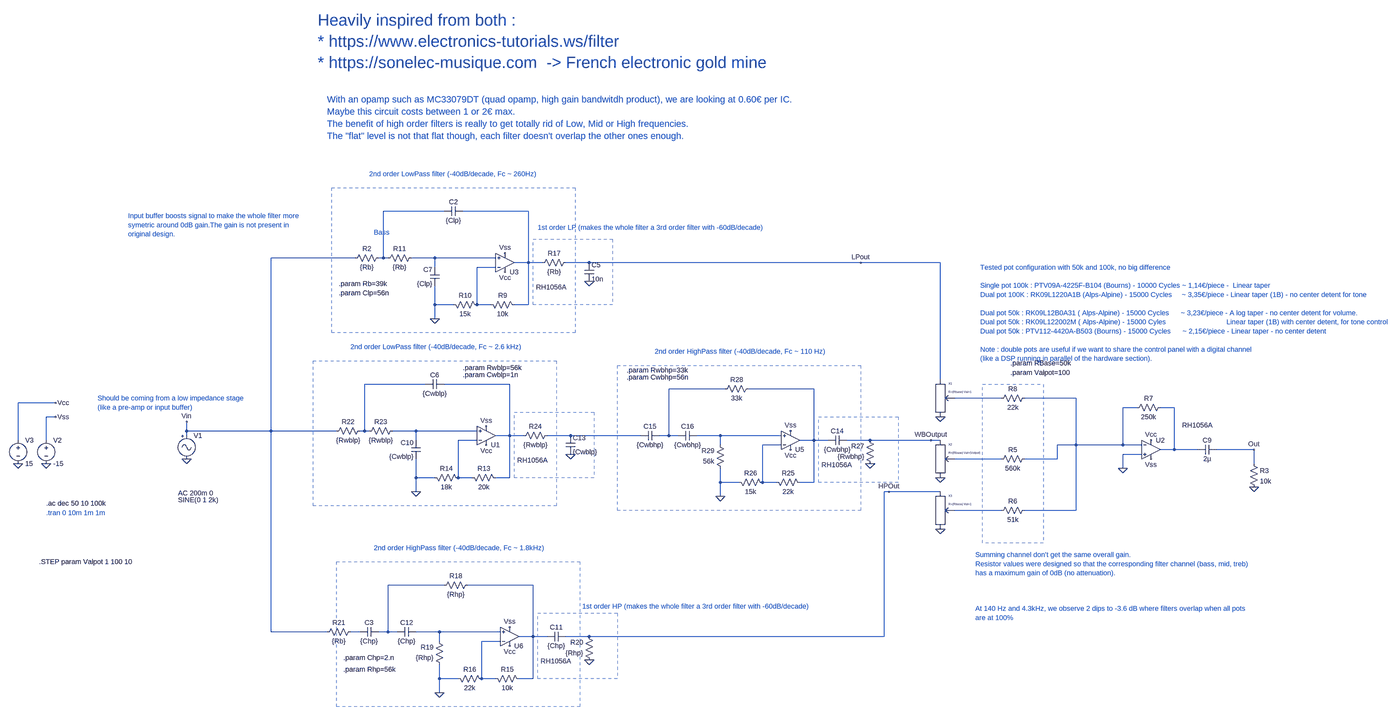
[diagram p0: schematic ActiveTMBInputTonestack.asc, whole sheet]
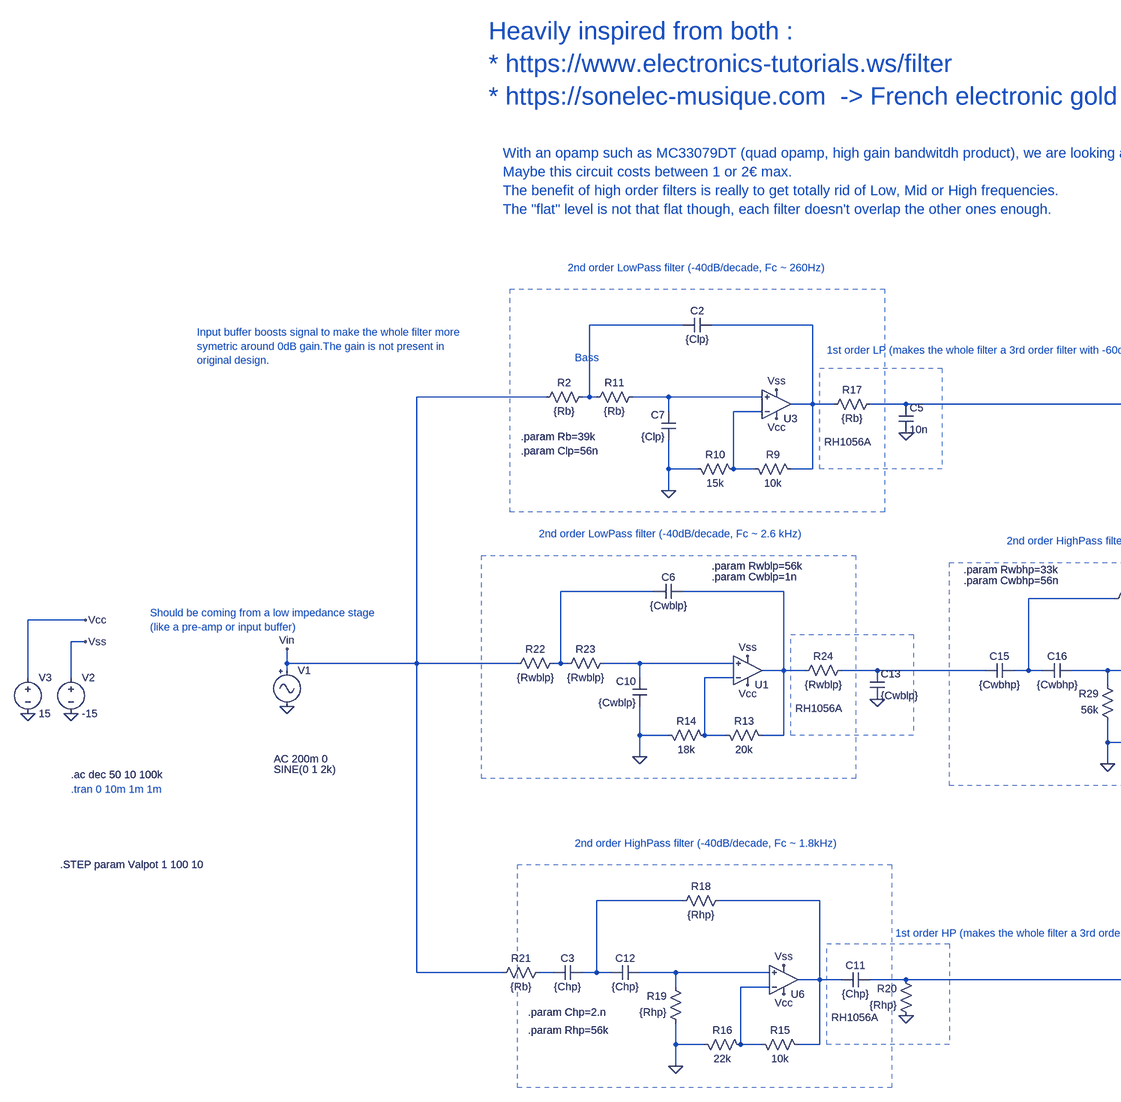
[diagram p1: schematic ActiveTMBInputTonestack.asc, part, row 1 of 1, column 1 of 2]
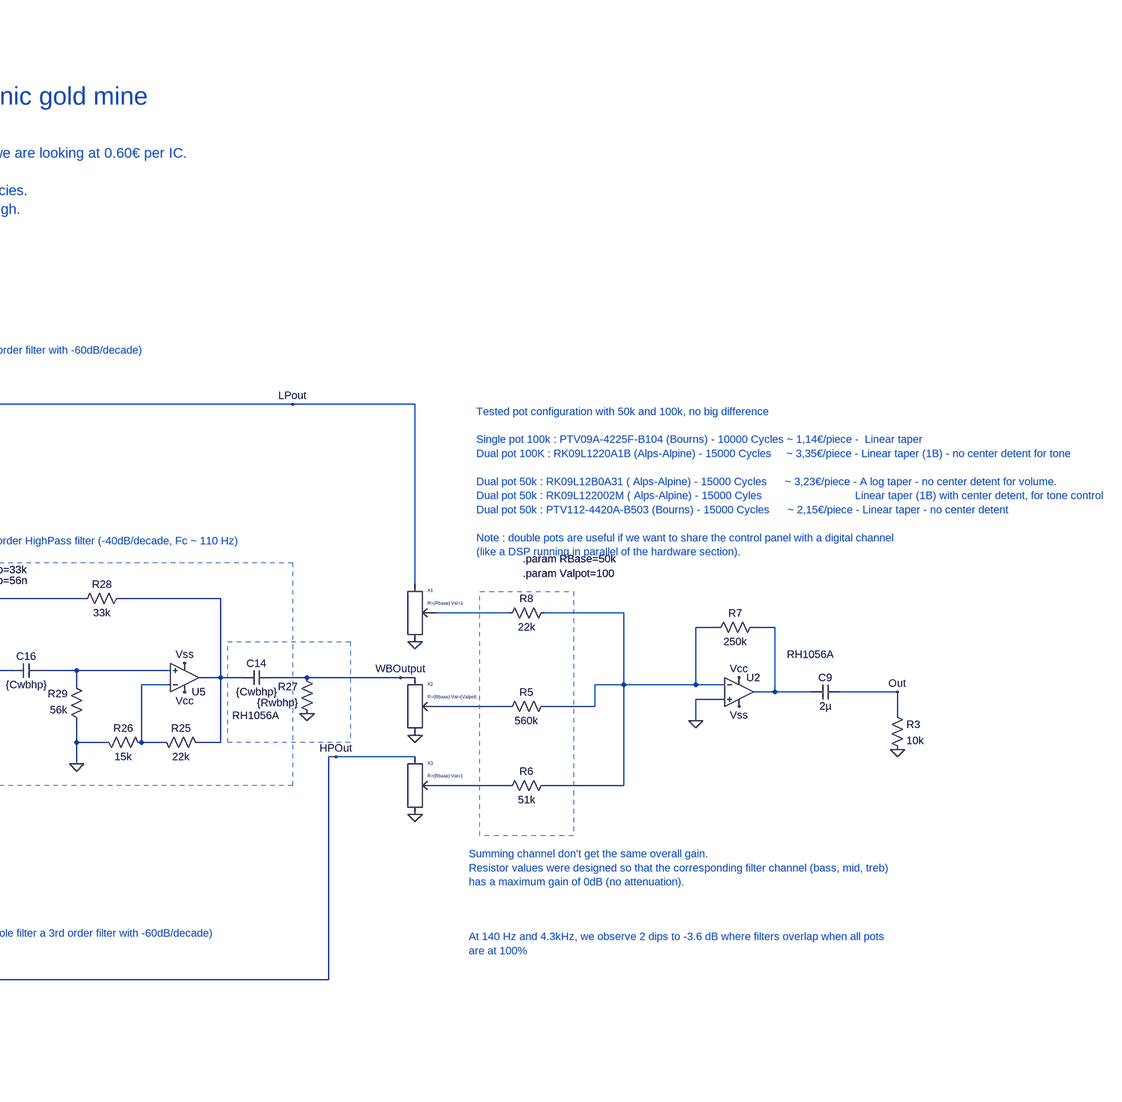
[diagram p2: schematic ActiveTMBInputTonestack.asc, part, row 1 of 1, column 2 of 2]
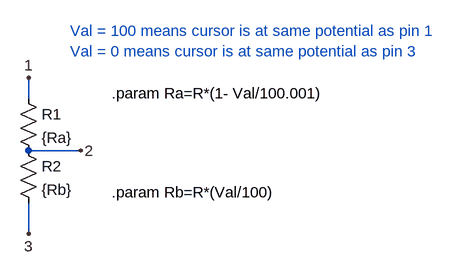
[diagram p3: sub-circuit potentiometer.asc]
ActiveTMBInputTonestack.asc, the LTspice schematic file:
Version 4
SHEET 1 4712 2500
WIRE 704 -304 496 -304
WIRE 992 -304 768 -304
WIRE 400 -144 112 -144
WIRE 496 -144 496 -304
WIRE 496 -144 480 -144
WIRE 512 -144 496 -144
WIRE 672 -144 592 -144
WIRE 880 -144 672 -144
WIRE 992 -128 992 -304
WIRE 992 -128 944 -128
WIRE 1040 -128 992 -128
WIRE 1200 -128 1120 -128
WIRE 2128 -128 1200 -128
WIRE 2400 -128 2128 -128
WIRE 672 -112 672 -144
WIRE 880 -112 816 -112
WIRE 672 16 672 -48
WIRE 736 16 672 16
WIRE 816 16 816 -112
WIRE 864 16 816 16
WIRE 992 16 992 -128
WIRE 992 16 944 16
WIRE 672 64 672 16
WIRE 2400 272 2400 -128
WIRE 640 288 432 288
WIRE 928 288 704 288
WIRE 1664 304 1472 304
WIRE 1968 304 1744 304
WIRE 2608 336 2448 336
WIRE 2864 336 2688 336
WIRE -624 352 -752 352
WIRE 3072 368 3024 368
WIRE 3200 368 3152 368
WIRE -624 400 -656 400
WIRE -176 448 -176 416
WIRE 112 448 112 -144
WIRE 112 448 -176 448
WIRE 336 448 112 448
WIRE 432 448 432 288
WIRE 432 448 416 448
WIRE 448 448 432 448
WIRE 608 448 528 448
WIRE 816 448 608 448
WIRE -176 464 -176 448
WIRE 928 464 928 288
WIRE 928 464 880 464
WIRE 976 464 928 464
WIRE 1136 464 1056 464
WIRE 1376 464 1136 464
WIRE 1472 464 1472 304
WIRE 1472 464 1440 464
WIRE 1504 464 1472 464
WIRE 1648 464 1568 464
WIRE 1856 464 1648 464
WIRE -752 480 -752 352
WIRE -656 480 -656 400
WIRE 608 480 608 448
WIRE 816 480 752 480
WIRE 1968 480 1968 304
WIRE 1968 480 1920 480
WIRE 2016 480 1968 480
WIRE 2160 480 2080 480
WIRE 2368 480 2160 480
WIRE 2400 480 2368 480
WIRE 1648 496 1648 464
WIRE 1856 496 1792 496
WIRE 2864 496 2864 336
WIRE 2864 496 2800 496
WIRE 3024 496 3024 368
WIRE 3024 496 2864 496
WIRE 3088 496 3024 496
WIRE 3200 512 3200 368
WIRE 3200 512 3152 512
WIRE 3280 512 3200 512
WIRE 3472 512 3344 512
WIRE 3088 528 3024 528
WIRE 2608 544 2448 544
WIRE 2800 544 2800 496
WIRE 2800 544 2688 544
WIRE 3472 560 3472 512
WIRE 3024 576 3024 528
WIRE 608 608 608 544
WIRE 672 608 608 608
WIRE 752 608 752 480
WIRE 800 608 752 608
WIRE 928 608 928 464
WIRE 928 608 880 608
WIRE 1648 624 1648 576
WIRE 1712 624 1648 624
WIRE 1792 624 1792 496
WIRE 1840 624 1792 624
WIRE 1968 624 1968 480
WIRE 1968 624 1920 624
WIRE 608 656 608 608
WIRE 2224 656 2208 656
WIRE 2400 656 2224 656
WIRE 1648 672 1648 624
WIRE 2608 720 2448 720
WIRE 2864 720 2864 496
WIRE 2864 720 2688 720
WIRE 704 976 512 976
WIRE 1008 976 784 976
WIRE 112 1136 112 448
WIRE 304 1136 112 1136
WIRE 416 1136 384 1136
WIRE 512 1136 512 976
WIRE 512 1136 480 1136
WIRE 544 1136 512 1136
WIRE 688 1136 608 1136
WIRE 896 1136 688 1136
WIRE 1008 1152 1008 976
WIRE 1008 1152 960 1152
WIRE 1056 1152 1008 1152
WIRE 1200 1152 1120 1152
WIRE 2208 1152 2208 656
WIRE 2208 1152 1200 1152
WIRE 688 1168 688 1136
WIRE 896 1168 832 1168
WIRE 688 1296 688 1248
WIRE 752 1296 688 1296
WIRE 832 1296 832 1168
WIRE 880 1296 832 1296
WIRE 1008 1296 1008 1152
WIRE 1008 1296 960 1296
WIRE 688 1344 688 1296
FLAG -752 560 0
FLAG -656 560 0
FLAG -176 544 0
FLAG 3472 640 0
FLAG 3472 512 Out
FLAG 2400 608 0
FLAG 2400 784 0
FLAG 3120 480 Vcc
FLAG 3120 544 Vss
FLAG 3024 576 0
FLAG 912 -96 Vcc
FLAG 912 -160 Vss
FLAG 672 64 0
FLAG 2400 400 0
FLAG 1200 -64 0
FLAG 2128 -128 LPout
FLAG 928 1184 Vcc
FLAG 928 1120 Vss
FLAG 688 1344 0
FLAG 1200 1232 0
FLAG 2224 656 HPOut
FLAG -176 416 Vin
FLAG -624 400 Vss
FLAG -624 352 Vcc
FLAG 848 496 Vcc
FLAG 848 432 Vss
FLAG 608 656 0
FLAG 1136 528 0
FLAG 1888 512 Vcc
FLAG 1888 448 Vss
FLAG 1648 672 0
FLAG 2160 560 0
FLAG 2368 480 WBOutput
SYMBOL Misc\\signal -176 448 R0
WINDOW 123 -29 213 Left 2
WINDOW 39 0 0 Left 0
WINDOW 3 -29 236 Left 2
SYMATTR Value2 AC 200m 0
SYMATTR Value SINE(0 1 2k)
SYMATTR InstName V1
SYMBOL voltage -656 464 R0
WINDOW 123 0 0 Left 0
WINDOW 39 0 0 Left 0
SYMATTR InstName V2
SYMATTR Value -15
SYMBOL voltage -752 464 R0
WINDOW 123 0 0 Left 0
WINDOW 39 0 0 Left 0
SYMATTR InstName V3
SYMATTR Value 15
SYMBOL res 3456 544 R0
SYMATTR InstName R3
SYMATTR Value 10k
SYMBOL cap 3344 496 R90
WINDOW 0 0 32 VBottom 2
WINDOW 3 32 32 VTop 2
SYMATTR InstName C9
SYMATTR Value 2µ
SYMBOL Potentiometer 2400 544 R0
WINDOW 39 28 -21 Left 0
SYMATTR SpiceLine R={Rbase} Val={Valpot}
SYMATTR InstName X2
SYMBOL Potentiometer 2400 720 R0
WINDOW 39 28 -21 Left 0
SYMATTR SpiceLine R={Rbase} Val=1
SYMATTR InstName X3
SYMBOL OpAmps\\RH1056A 3120 448 R0
WINDOW 3 106 -20 Left 2
SYMATTR InstName U2
SYMBOL res 3168 352 R90
WINDOW 0 0 56 VBottom 2
WINDOW 3 32 56 VTop 2
SYMATTR InstName R7
SYMATTR Value 250k
SYMBOL res 2704 320 R90
WINDOW 0 0 56 VBottom 2
WINDOW 3 32 56 VTop 2
SYMATTR InstName R8
SYMATTR Value 22k
SYMBOL res 2704 528 R90
WINDOW 0 0 56 VBottom 2
WINDOW 3 32 56 VTop 2
SYMATTR InstName R5
SYMATTR Value 560k
SYMBOL res 2704 704 R90
WINDOW 0 0 56 VBottom 2
WINDOW 3 32 56 VTop 2
SYMATTR InstName R6
SYMATTR Value 51k
SYMBOL OpAmps\\RH1056A 912 -64 M180
WINDOW 3 106 -20 Left 2
SYMATTR InstName U3
SYMBOL res 960 32 M270
WINDOW 0 32 56 VTop 2
WINDOW 3 0 56 VBottom 2
SYMATTR InstName R9
SYMATTR Value 10k
SYMBOL res 832 32 M270
WINDOW 0 32 56 VTop 2
WINDOW 3 0 56 VBottom 2
SYMATTR InstName R10
SYMATTR Value 15k
SYMBOL cap 768 -320 R90
WINDOW 0 0 32 VBottom 2
WINDOW 3 32 32 VTop 2
SYMATTR InstName C2
SYMATTR Value {Clp}
SYMBOL cap 688 -48 R180
WINDOW 0 24 56 Left 2
WINDOW 3 24 8 Left 2
SYMATTR InstName C7
SYMATTR Value {Clp}
SYMBOL res 496 -160 R90
WINDOW 0 0 56 VBottom 2
WINDOW 3 32 56 VTop 2
SYMATTR InstName R2
SYMATTR Value {Rb}
SYMBOL res 608 -160 R90
WINDOW 0 0 56 VBottom 2
WINDOW 3 32 56 VTop 2
SYMATTR InstName R11
SYMATTR Value {Rb}
SYMBOL Potentiometer 2400 336 R0
WINDOW 39 28 -21 Left 0
SYMATTR SpiceLine R={Rbase} Val=1
SYMATTR InstName X1
SYMBOL res 1136 -144 R90
WINDOW 0 0 56 VBottom 2
WINDOW 3 32 56 VTop 2
SYMATTR InstName R17
SYMATTR Value {Rb}
SYMBOL cap 1184 -128 R0
SYMATTR InstName C5
SYMATTR Value 10n
SYMBOL OpAmps\\RH1056A 928 1216 M180
WINDOW 3 106 -20 Left 2
SYMATTR InstName U6
SYMBOL res 976 1312 M270
WINDOW 0 32 56 VTop 2
WINDOW 3 0 56 VBottom 2
SYMATTR InstName R15
SYMATTR Value 10k
SYMBOL res 848 1312 M270
WINDOW 0 32 56 VTop 2
WINDOW 3 0 56 VBottom 2
SYMATTR InstName R16
SYMATTR Value 22k
SYMBOL res 1216 1248 R180
WINDOW 0 36 76 Left 2
WINDOW 3 36 40 Left 2
SYMATTR InstName R20
SYMATTR Value {Rhp}
SYMBOL cap 1120 1136 R90
WINDOW 0 0 32 VBottom 2
WINDOW 3 32 32 VTop 2
SYMATTR InstName C11
SYMATTR Value {Chp}
SYMBOL cap 480 1120 R90
WINDOW 0 0 32 VBottom 2
WINDOW 3 32 32 VTop 2
SYMATTR InstName C3
SYMATTR Value {Chp}
SYMBOL cap 608 1120 R90
WINDOW 0 0 32 VBottom 2
WINDOW 3 32 32 VTop 2
SYMATTR InstName C12
SYMATTR Value {Chp}
SYMBOL res 800 960 R90
WINDOW 0 0 56 VBottom 2
WINDOW 3 32 56 VTop 2
SYMATTR InstName R18
SYMATTR Value {Rhp}
SYMBOL res 704 1264 R180
WINDOW 0 36 76 Left 2
WINDOW 3 36 40 Left 2
SYMATTR InstName R19
SYMATTR Value {Rhp}
SYMBOL res 400 1120 R90
WINDOW 0 0 56 VBottom 2
WINDOW 3 32 56 VTop 2
SYMATTR InstName R21
SYMATTR Value {Rb}
SYMBOL OpAmps\\RH1056A 848 528 M180
WINDOW 3 106 -20 Left 2
SYMATTR InstName U1
SYMBOL res 896 624 M270
WINDOW 0 32 56 VTop 2
WINDOW 3 0 56 VBottom 2
SYMATTR InstName R13
SYMATTR Value 20k
SYMBOL res 768 624 M270
WINDOW 0 32 56 VTop 2
WINDOW 3 0 56 VBottom 2
SYMATTR InstName R14
SYMATTR Value 18k
SYMBOL cap 704 272 R90
WINDOW 0 0 32 VBottom 2
WINDOW 3 32 32 VTop 2
SYMATTR InstName C6
SYMATTR Value {Cwblp}
SYMBOL cap 624 544 R180
WINDOW 0 24 56 Left 2
WINDOW 3 24 8 Left 2
SYMATTR InstName C10
SYMATTR Value {Cwblp}
SYMBOL res 432 432 R90
WINDOW 0 0 56 VBottom 2
WINDOW 3 32 56 VTop 2
SYMATTR InstName R22
SYMATTR Value {Rwblp}
SYMBOL res 544 432 R90
WINDOW 0 0 56 VBottom 2
WINDOW 3 32 56 VTop 2
SYMATTR InstName R23
SYMATTR Value {Rwblp}
SYMBOL res 1072 448 R90
WINDOW 0 0 56 VBottom 2
WINDOW 3 32 56 VTop 2
SYMATTR InstName R24
SYMATTR Value {Rwblp}
SYMBOL cap 1120 464 R0
SYMATTR InstName C13
SYMATTR Value {Cwblp}
SYMBOL OpAmps\\RH1056A 1888 544 M180
WINDOW 3 106 -20 Left 2
SYMATTR InstName U5
SYMBOL res 1936 640 M270
WINDOW 0 32 56 VTop 2
WINDOW 3 0 56 VBottom 2
SYMATTR InstName R25
SYMATTR Value 22k
SYMBOL res 1808 640 M270
WINDOW 0 32 56 VTop 2
WINDOW 3 0 56 VBottom 2
SYMATTR InstName R26
SYMATTR Value 15k
SYMBOL res 2176 576 R180
WINDOW 0 36 76 Left 2
WINDOW 3 36 40 Left 2
SYMATTR InstName R27
SYMATTR Value {Rwbhp}
SYMBOL cap 2080 464 R90
WINDOW 0 0 32 VBottom 2
WINDOW 3 32 32 VTop 2
SYMATTR InstName C14
SYMATTR Value {Cwbhp}
SYMBOL cap 1440 448 R90
WINDOW 0 0 32 VBottom 2
WINDOW 3 32 32 VTop 2
SYMATTR InstName C15
SYMATTR Value {Cwbhp}
SYMBOL cap 1568 448 R90
WINDOW 0 0 32 VBottom 2
WINDOW 3 32 32 VTop 2
SYMATTR InstName C16
SYMATTR Value {Cwbhp}
SYMBOL res 1760 288 R90
WINDOW 0 0 56 VBottom 2
WINDOW 3 32 56 VTop 2
SYMATTR InstName R28
SYMATTR Value 33k
SYMBOL res 1664 592 R180
WINDOW 0 36 76 Left 2
WINDOW 3 36 40 Left 2
SYMATTR InstName R29
SYMATTR Value 56k
TEXT -656 696 Left 2 !.ac dec 50 10 100k
TEXT -680 896 Left 2 !.STEP param Valpot 1 100 10
TEXT -376 -288 Left 2 ;Input buffer boosts signal to make the whole filter more \nsymetric around 0dB gain.The gain is not present in\noriginal design.
TEXT 2640 216 Left 2 !.param RBase=50k
TEXT 464 -232 Left 2 ;Bass
TEXT 344 -56 Left 2 !.param Rb=39k
TEXT 448 -432 Left 2 ;2nd order LowPass filter (-40dB/decade, Fc ~ 260Hz)
TEXT 1024 -248 Left 2 ;1st order LP (makes the whole filter a 3rd order filter with -60dB/decade)
TEXT 360 1224 Left 2 !.param Chp=2.n
TEXT 464 848 Left 2 ;2nd order HighPass filter (-40dB/decade, Fc ~ 1.8kHz)
TEXT 360 1264 Left 2 !.param Rhp=56k
TEXT 344 -24 Left 2 !.param Clp=56n
TEXT -656 728 Left 2 ;.tran 0 10m 1m 1m
TEXT 2640 248 Left 2 !.param Valpot=100
TEXT 1176 1048 Left 2 ;1st order HP (makes the whole filter a 3rd order filter with -60dB/decade)
TEXT 272 -992 Left 5 ;Heavily inspired from both : \n* https://www.electronics-tutorials.ws/filter\n* https://sonelec-musique.com  -> French electronic gold mine
TEXT -480 336 Left 2 ;Should be coming from a low impedance stage\n(like a pre-amp or input buffer)
TEXT 304 -720 Left 3 ;With an opamp such as MC33079DT (quad opamp, high gain bandwitdh product), we are looking at 0.60€ per IC.\nMaybe this circuit costs between 1 or 2€ max.\nThe benefit of high order filters is really to get totally rid of Low, Mid or High frequencies.\nThe "flat" level is not that flat though, each filter doesn't overlap the other ones enough.
TEXT 2520 872 Left 2 ;Summing channel don't get the same overall gain.\nResistor values were designed so that the corresponding filter channel (bass, mid, treb)\nhas a maximum gain of 0dB (no attenuation).
TEXT 2536 -112 Left 2 ;Tested pot configuration with 50k and 100k, no big difference\n \nSingle pot 100k : PTV09A-4225F-B104 (Bourns) - 10000 Cycles ~ 1,14€/piece -  Linear taper\nDual pot 100K : RK09L1220A1B (Alps-Alpine) - 15000 Cycles     ~ 3,35€/piece - Linear taper (1B) - no center detent for tone\n \nDual pot 50k : RK09L12B0A31 ( Alps-Alpine) - 15000 Cycles      ~ 3,23€/piece - A log taper - no center detent for volume. \nDual pot 50k : RK09L122002M ( Alps-Alpine) - 15000 Cyles                               Linear taper (1B) with center detent, for tone control\nDual pot 50k : PTV112-4420A-B503 (Bourns) - 15000 Cycles      ~ 2,15€/piece - Linear taper - no center detent\n \nNote : double pots are useful if we want to share the control panel with a digital channel\n(like a DSP running in parallel of the hardware section).
TEXT 384 160 Left 2 ;2nd order LowPass filter (-40dB/decade, Fc ~ 2.6 kHz)
TEXT 1424 176 Left 2 ;2nd order HighPass filter (-40dB/decade, Fc ~ 110 Hz)
TEXT 1328 264 Left 2 !.param Cwbhp=56n
TEXT 1328 240 Left 2 !.param Rwbhp=33k
TEXT 768 256 Left 2 !.param Cwblp=1n
TEXT 768 232 Left 2 !.param Rwblp=56k
TEXT 2520 1056 Left 2 ;At 140 Hz and 4.3kHz, we observe 2 dips to -3.6 dB where filters overlap when all pots\nare at 100%
RECTANGLE Normal 1152 112 320 -384 2
RECTANGLE Normal 1280 16 1008 -208 2
RECTANGLE Normal 1168 1392 336 896 2
RECTANGLE Normal 1296 1296 1024 1072 2
RECTANGLE Normal 2752 832 2544 288 2
RECTANGLE Normal 1088 704 256 208 2
RECTANGLE Normal 1216 608 944 384 2
RECTANGLE Normal 2128 720 1296 224 2
RECTANGLE Normal 2256 624 1984 400 2

potentiometer.asc, the sub-circuit schematic file:
Version 4
SHEET 1 908 680
WIRE 192 96 192 64
WIRE 272 176 192 176
WIRE 192 304 192 256
FLAG 192 64 1
FLAG 272 176 2
FLAG 192 304 3
SYMBOL res 176 80 R0
SYMATTR InstName R1
SYMATTR Value {Ra}
SYMBOL res 176 160 R0
SYMATTR InstName R2
SYMATTR Value {Rb}
TEXT 320 88 Left 2 !.param Ra=R*(1- Val/100.001)
TEXT 320 240 Left 2 !.param Rb=R*(Val/100)
TEXT 256 -8 Left 2 ;Val = 100 means cursor is at same potential as pin 1\nVal = 0 means cursor is at same potential as pin 3

The netlist it stands for:
* ActiveTMBInputTonestack.asc
V1 Vin 0 SINE(0 1 2k) AC 200m 0
V2 Vss 0 -15
V3 Vcc 0 15
R3 Out 0 10k
C9 Out N011 2µ
XX2 WBOutput N017 0 potentiometer params: R={Rbase} Val={Valpot}
XX3 HPOut N018 0 potentiometer params: R={Rbase} Val=1
XU2 0 N010 Vcc Vss N011 RH1056A  ; pins In+ In- V+ V- OUT
R7 N011 N010 250k
R8 N010 N009 22k
R5 N010 N017 560k
R6 N010 N018 51k
XU3 N003 N004 Vcc Vss N002 RH1056A  ; pins In+ In- V+ V- OUT
R9 N002 N004 10k
R10 N004 0 15k
C2 N002 N001 {Clp}
C7 0 N003 {Clp}
R2 N001 Vin {Rb}
R11 N003 N001 {Rb}
XX1 LPout N009 0 potentiometer params: R={Rbase} Val=1
R17 LPout N002 {Rb}
C5 LPout 0 10n
XU6 N022 N023 Vcc Vss N020 RH1056A  ; pins In+ In- V+ V- OUT
R15 N020 N023 10k
R16 N023 0 22k
R20 0 HPOut {Rhp}
C11 HPOut N020 {Chp}
C3 N019 N021 {Chp}
C12 N022 N019 {Chp}
R18 N020 N019 {Rhp}
R19 0 N022 {Rhp}
R21 N021 Vin {Rb}
XU1 N012 N015 Vcc Vss N006 RH1056A  ; pins In+ In- V+ V- OUT
R13 N006 N015 20k
R14 N015 0 18k
C6 N006 N005 {Cwblp}
C10 0 N012 {Cwblp}
R22 N005 Vin {Rwblp}
R23 N012 N005 {Rwblp}
R24 N013 N006 {Rwblp}
C13 N013 0 {Cwblp}
XU5 N014 N016 Vcc Vss N008 RH1056A  ; pins In+ In- V+ V- OUT
R25 N008 N016 22k
R26 N016 0 15k
R27 0 WBOutput {Rwbhp}
C14 WBOutput N008 {Cwbhp}
C15 N007 N013 {Cwbhp}
C16 N014 N007 {Cwbhp}
R28 N008 N007 33k
R29 0 N014 56k

* block symbol definitions
.subckt potentiometer 1 2 3
R1 1 2 {Ra}
R2 2 3 {Rb}
.param Ra=R*(1- Val/100.001)
.param Rb=R*(Val/100)
* Val = 100 means cursor is at same potential as pin 1
* Val = 0 means cursor is at same potential as pin 3
.ends potentiometer

.ac dec 50 10 100k
.STEP param Valpot 1 100 10
* Input buffer boosts signal to make the whole filter more
* symetric around 0dB gain.The gain is not present in
* original design.
.param RBase=50k
* Bass
.param Rb=39k
* 2nd order LowPass filter (-40dB/decade, Fc ~ 260Hz)
* 1st order LP (makes the whole filter a 3rd order filter with -60dB/decade)
.param Chp=2.n
* 2nd order HighPass filter (-40dB/decade, Fc ~ 1.8kHz)
.param Rhp=56k
.param Clp=56n
* .tran 0 10m 1m 1m
.param Valpot=100
* 1st order HP (makes the whole filter a 3rd order filter with -60dB/decade)
* Heavily inspired from both :
* * https://www.electronics-tutorials.ws/filter
* * https://sonelec-musique.com  -> French electronic gold mine
* Should be coming from a low impedance stage
* (like a pre-amp or input buffer)
* With an opamp such as MC33079DT (quad opamp, high gain bandwitdh product), we are looking at 0.60€ per IC.
* Maybe this circuit costs between 1 or 2€ max.
* The benefit of high order filters is really to get totally rid of Low, Mid or High frequencies.
* The "flat" level is not that flat though, each filter doesn't overlap the other ones enough.
* Summing channel don't get the same overall gain.
* Resistor values were designed so that the corresponding filter channel (bass, mid, treb)
* has a maximum gain of 0dB (no attenuation).
* Tested pot configuration with 50k and 100k, no big difference
* Single pot 100k : PTV09A-4225F-B104 (Bourns) - 10000 Cycles ~ 1,14€/piece -  Linear taper
* Dual pot 100K : RK09L1220A1B (Alps-Alpine) - 15000 Cycles     ~ 3,35€/piece - Linear taper (1B) - no center detent for tone
* Dual pot 50k : RK09L12B0A31 ( Alps-Alpine) - 15000 Cycles      ~ 3,23€/piece - A log taper - no center detent for volume.
* Dual pot 50k : RK09L122002M ( Alps-Alpine) - 15000 Cyles                               Linear taper (1B) with center detent, for tone control
* Dual pot 50k : PTV112-4420A-B503 (Bourns) - 15000 Cycles      ~ 2,15€/piece - Linear taper - no center detent
* Note : double pots are useful if we want to share the control panel with a digital channel
* (like a DSP running in parallel of the hardware section).
* 2nd order LowPass filter (-40dB/decade, Fc ~ 2.6 kHz)
* 2nd order HighPass filter (-40dB/decade, Fc ~ 110 Hz)
.param Cwbhp=56n
.param Rwbhp=33k
.param Cwblp=1n
.param Rwblp=56k
* At 140 Hz and 4.3kHz, we observe 2 dips to -3.6 dB where filters overlap when all pots
* are at 100%
.backanno
.end